# EAGLE design Car_Board (EAGLE 6.4)
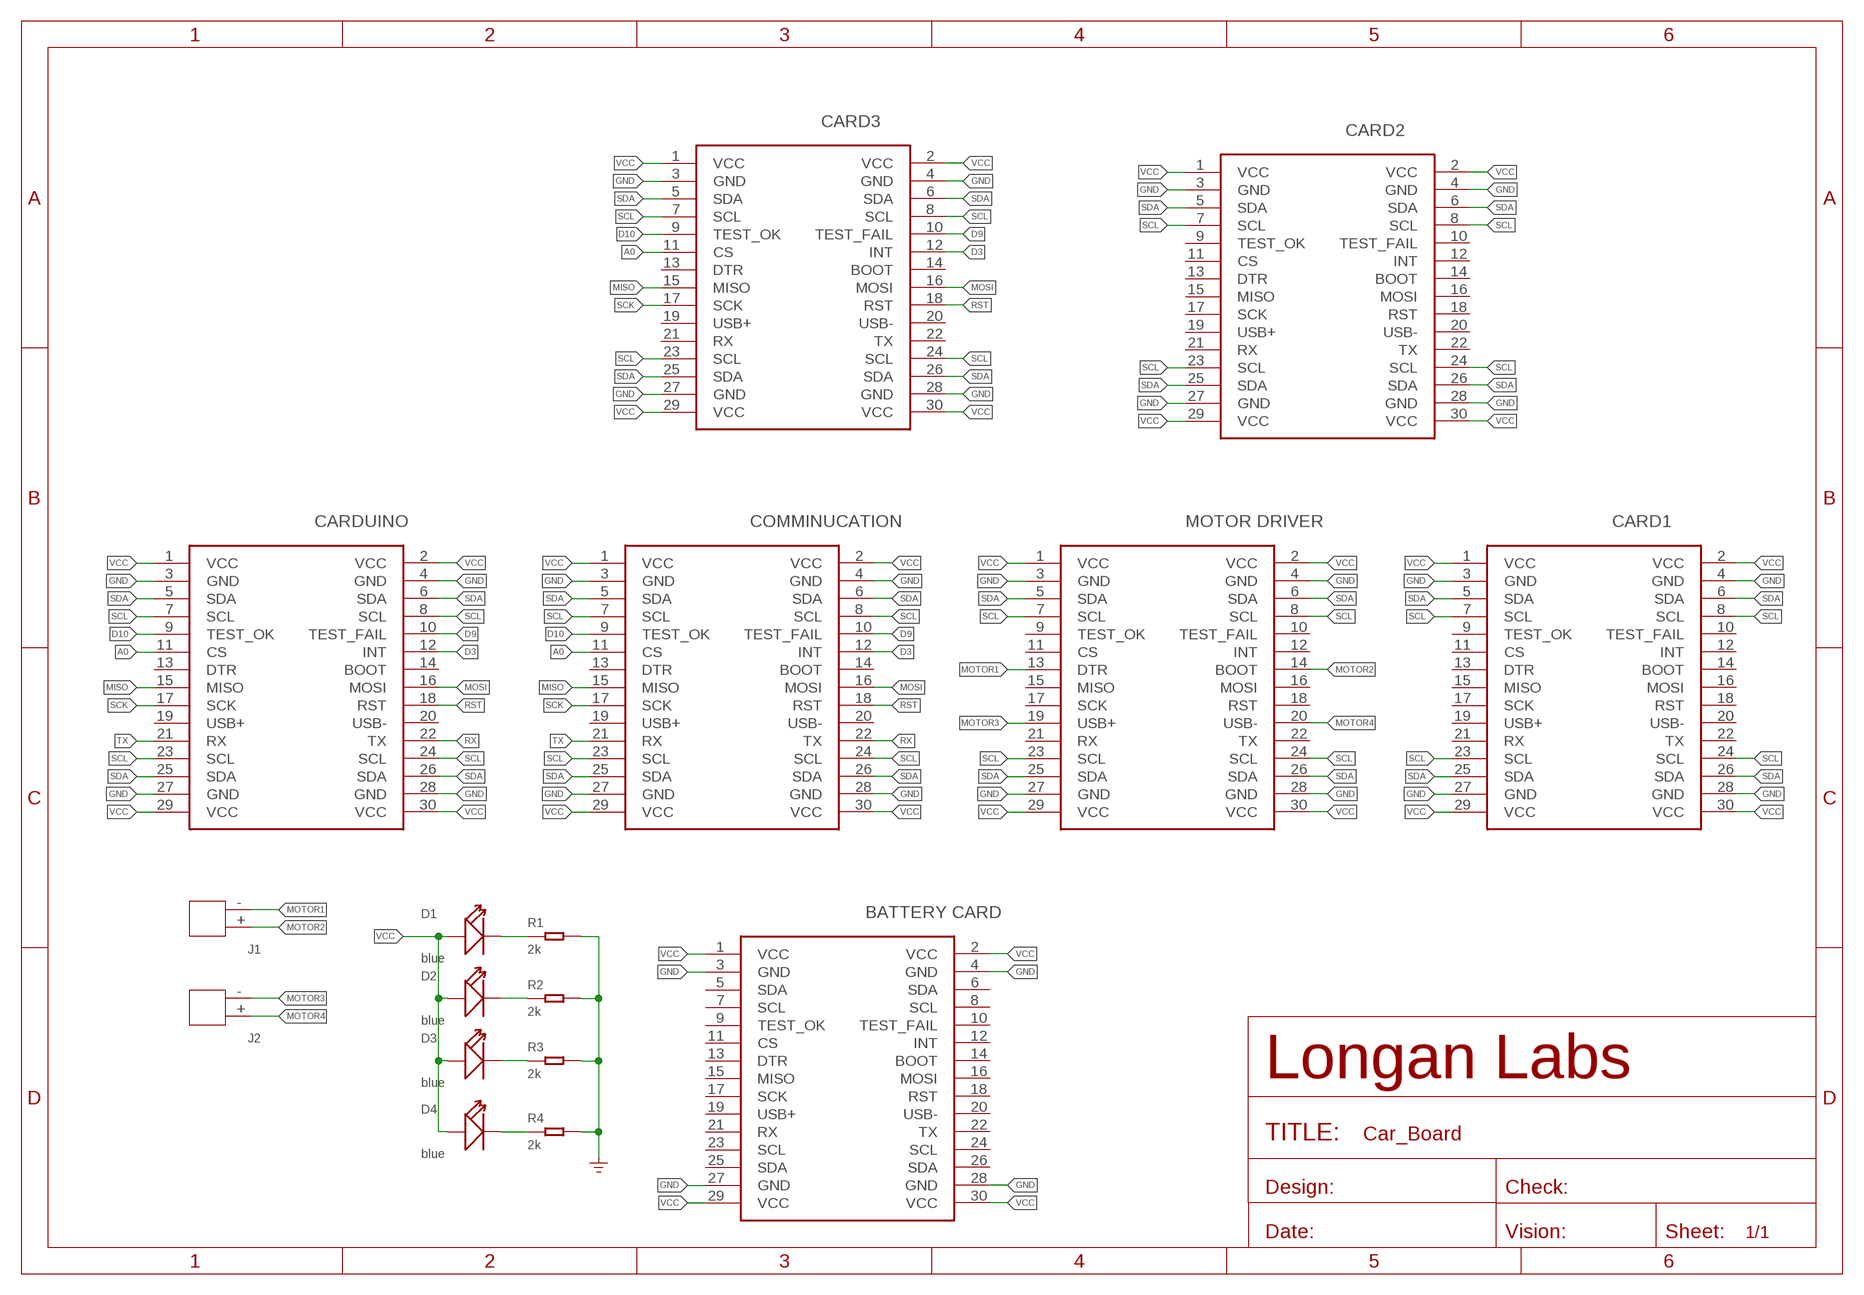
[diagram p0: schematic, sheet 1]

## Parts
CARDUINO  CARDUINO  MOUDLE-2X15P-2.54'2.54'  [2X15P-2.54]
CARDUINO1  COMMINUCATION  MOUDLE-2X15P-2.54'2.54'  [2X15P-2.54]
CARDUINO2  MOTOR DRIVER  MOUDLE-2X15P-2.54'2.54'  [2X15P-2.54]
CARDUINO3  CARD1  MOUDLE-2X15P-2.54'2.54'  [2X15P-2.54]
CARDUINO4  CARD2  MOUDLE-2X15P-2.54'2.54'  [2X15P-2.54]
CARDUINO5  CARD3  MOUDLE-2X15P-2.54'90D'  [2X15P-2.54-90D]
D1  blue  LED'0603'  [LED-0603]
D2  blue  LED'0603'  [LED-0603]
D3  blue  LED'0603'  [LED-0603]
D4  blue  LED'0603'  [LED-0603]
J1  JST-2P-DIP'2.0'  [H2-2.0-6X4.5MM]
J2  JST-2P-DIP'2.0'  [H2-2.0-6X4.5MM]
MOUDLE4  BATTERY CARD  MOUDLE-2X15P-2.54'2.54'  [2X15P-2.54]
R1  2k  RES-0603  [R0603]
R2  2k  RES-0603  [R0603]
R3  2k  RES-0603  [R0603]
R4  2k  RES-0603  [R0603]

## Nets
A0: CARDUINO1.11(CS) CARDUINO5.11(CS) CARDUINO.11(CS)
D3: CARDUINO1.12(INT) CARDUINO5.12(INT) CARDUINO.12(INT)
D9: CARDUINO1.10(TEST_FAIL) CARDUINO5.10(TEST_FAIL) CARDUINO.10(TEST_FAIL)
D10: CARDUINO1.9(TEST_OK) CARDUINO5.9(TEST_OK) CARDUINO.9(TEST_OK)
GND: CARDUINO1.3(GND) CARDUINO1.4(GND) CARDUINO1.27(GND) CARDUINO1.28(GND) CARDUINO2.3(GND) CARDUINO2.4(GND) CARDUINO2.27(GND) CARDUINO2.28(GND) CARDUINO3.3(GND) CARDUINO3.4(GND) CARDUINO3.27(GND) CARDUINO3.28(GND) CARDUINO4.3(GND) CARDUINO4.4(GND) CARDUINO4.27(GND) CARDUINO4.28(GND) CARDUINO5.3(GND) CARDUINO5.4(GND) CARDUINO5.27(GND) CARDUINO5.28(GND) CARDUINO.3(GND) CARDUINO.4(GND) CARDUINO.27(GND) CARDUINO.28(GND) MOUDLE4.3(GND) MOUDLE4.4(GND) MOUDLE4.27(GND) MOUDLE4.28(GND) R1.2 R2.2 R3.2 R4.2 ; supply symbol labelled GND_POWER
MISO: CARDUINO1.15(MISO) CARDUINO5.15(MISO) CARDUINO.15(MISO)
MOSI: CARDUINO1.16(MOSI) CARDUINO5.16(MOSI) CARDUINO.16(MOSI)
MOTOR1: CARDUINO2.13(DTR) J1.-
MOTOR2: CARDUINO2.14(BOOT) J1.+
MOTOR3: CARDUINO2.19(USB+) J2.-
MOTOR4: CARDUINO2.20(USB-) J2.+
N$5: D1.- R1.1
N$6: D2.- R2.1
N$7: D3.- R3.1
N$8: D4.- R4.1
RST: CARDUINO1.18(RST) CARDUINO5.18(RST) CARDUINO.18(RST)
RX: CARDUINO1.22(TX) CARDUINO.22(TX)
SCK: CARDUINO1.17(SCK) CARDUINO5.17(SCK) CARDUINO.17(SCK)
SCL: CARDUINO1.7(SCL) CARDUINO1.8(SCL) CARDUINO1.23(SCL) CARDUINO1.24(SCL) CARDUINO2.7(SCL) CARDUINO2.8(SCL) CARDUINO2.23(SCL) CARDUINO2.24(SCL) CARDUINO3.7(SCL) CARDUINO3.8(SCL) CARDUINO3.23(SCL) CARDUINO3.24(SCL) CARDUINO4.7(SCL) CARDUINO4.8(SCL) CARDUINO4.23(SCL) CARDUINO4.24(SCL) CARDUINO5.7(SCL) CARDUINO5.8(SCL) CARDUINO5.23(SCL) CARDUINO5.24(SCL) CARDUINO.7(SCL) CARDUINO.8(SCL) CARDUINO.23(SCL) CARDUINO.24(SCL)
SDA: CARDUINO1.5(SDA) CARDUINO1.6(SDA) CARDUINO1.25(SDA) CARDUINO1.26(SDA) CARDUINO2.5(SDA) CARDUINO2.6(SDA) CARDUINO2.25(SDA) CARDUINO2.26(SDA) CARDUINO3.5(SDA) CARDUINO3.6(SDA) CARDUINO3.25(SDA) CARDUINO3.26(SDA) CARDUINO4.5(SDA) CARDUINO4.6(SDA) CARDUINO4.25(SDA) CARDUINO4.26(SDA) CARDUINO5.5(SDA) CARDUINO5.6(SDA) CARDUINO5.25(SDA) CARDUINO5.26(SDA) CARDUINO.5(SDA) CARDUINO.6(SDA) CARDUINO.25(SDA) CARDUINO.26(SDA)
TX: CARDUINO1.21(RX) CARDUINO.21(RX)
VCC: CARDUINO1.1(VCC) CARDUINO1.2(VCC) CARDUINO1.29(VCC) CARDUINO1.30(VCC) CARDUINO2.1(VCC) CARDUINO2.2(VCC) CARDUINO2.29(VCC) CARDUINO2.30(VCC) CARDUINO3.1(VCC) CARDUINO3.2(VCC) CARDUINO3.29(VCC) CARDUINO3.30(VCC) CARDUINO4.1(VCC) CARDUINO4.2(VCC) CARDUINO4.29(VCC) CARDUINO4.30(VCC) CARDUINO5.1(VCC) CARDUINO5.2(VCC) CARDUINO5.29(VCC) CARDUINO5.30(VCC) CARDUINO.1(VCC) CARDUINO.2(VCC) CARDUINO.29(VCC) CARDUINO.30(VCC) D1.+ D2.+ D3.+ D4.+ MOUDLE4.1(VCC) MOUDLE4.2(VCC) MOUDLE4.29(VCC) MOUDLE4.30(VCC)
Unconnected: CARDUINO1.13(DTR) CARDUINO1.14(BOOT) CARDUINO1.19(USB+) CARDUINO1.20(USB-) CARDUINO2.9(TEST_OK) CARDUINO2.10(TEST_FAIL) CARDUINO2.11(CS) CARDUINO2.12(INT) CARDUINO2.15(MISO) CARDUINO2.16(MOSI) CARDUINO2.17(SCK) CARDUINO2.18(RST) CARDUINO2.21(RX) CARDUINO2.22(TX) CARDUINO3.9(TEST_OK) CARDUINO3.10(TEST_FAIL) CARDUINO3.11(CS) CARDUINO3.12(INT) CARDUINO3.13(DTR) CARDUINO3.14(BOOT) CARDUINO3.15(MISO) CARDUINO3.16(MOSI) CARDUINO3.17(SCK) CARDUINO3.18(RST) CARDUINO3.19(USB+) CARDUINO3.20(USB-) CARDUINO3.21(RX) CARDUINO3.22(TX) CARDUINO4.9(TEST_OK) CARDUINO4.10(TEST_FAIL) CARDUINO4.11(CS) CARDUINO4.12(INT) CARDUINO4.13(DTR) CARDUINO4.14(BOOT) CARDUINO4.15(MISO) CARDUINO4.16(MOSI) CARDUINO4.17(SCK) CARDUINO4.18(RST) CARDUINO4.19(USB+) CARDUINO4.20(USB-) CARDUINO4.21(RX) CARDUINO4.22(TX) CARDUINO5.13(DTR) CARDUINO5.14(BOOT) CARDUINO5.19(USB+) CARDUINO5.20(USB-) CARDUINO5.21(RX) CARDUINO5.22(TX) CARDUINO.13(DTR) CARDUINO.14(BOOT) CARDUINO.19(USB+) CARDUINO.20(USB-) MOUDLE4.5(SDA) MOUDLE4.6(SDA) MOUDLE4.7(SCL) MOUDLE4.8(SCL) MOUDLE4.9(TEST_OK) MOUDLE4.10(TEST_FAIL) MOUDLE4.11(CS) MOUDLE4.12(INT) MOUDLE4.13(DTR) MOUDLE4.14(BOOT) MOUDLE4.15(MISO) MOUDLE4.16(MOSI) MOUDLE4.17(SCK) MOUDLE4.18(RST) MOUDLE4.19(USB+) MOUDLE4.20(USB-) MOUDLE4.21(RX) MOUDLE4.22(TX) MOUDLE4.23(SCL) MOUDLE4.24(SCL) MOUDLE4.25(SDA) MOUDLE4.26(SDA)

## Library data of the parts
CARDUINO CARDUINO1-CARDUINO5 MOUDLE4 = Longan-moudle:MOUDLE-2X15P-2.54
D1-D4 = Discrete-new:LED
J1 J2 = Connector-new:JST-2P-DIP: 2P-2.0:320110049;2P-2.0-90D:320110027;2P-2.54:320110053;2P-2.54-90D:320110000
R1-R4 = Discrete-new:RES

## Net classes
0 default: width 0.152 mm, clearance 0.152 mm
2 gnd: width 0.152 mm, drill 0.152 mm, clearance 0.152 mm
3 usbvcc: width 0.152 mm, drill 0.152 mm, clearance 0.152 mm

## Board
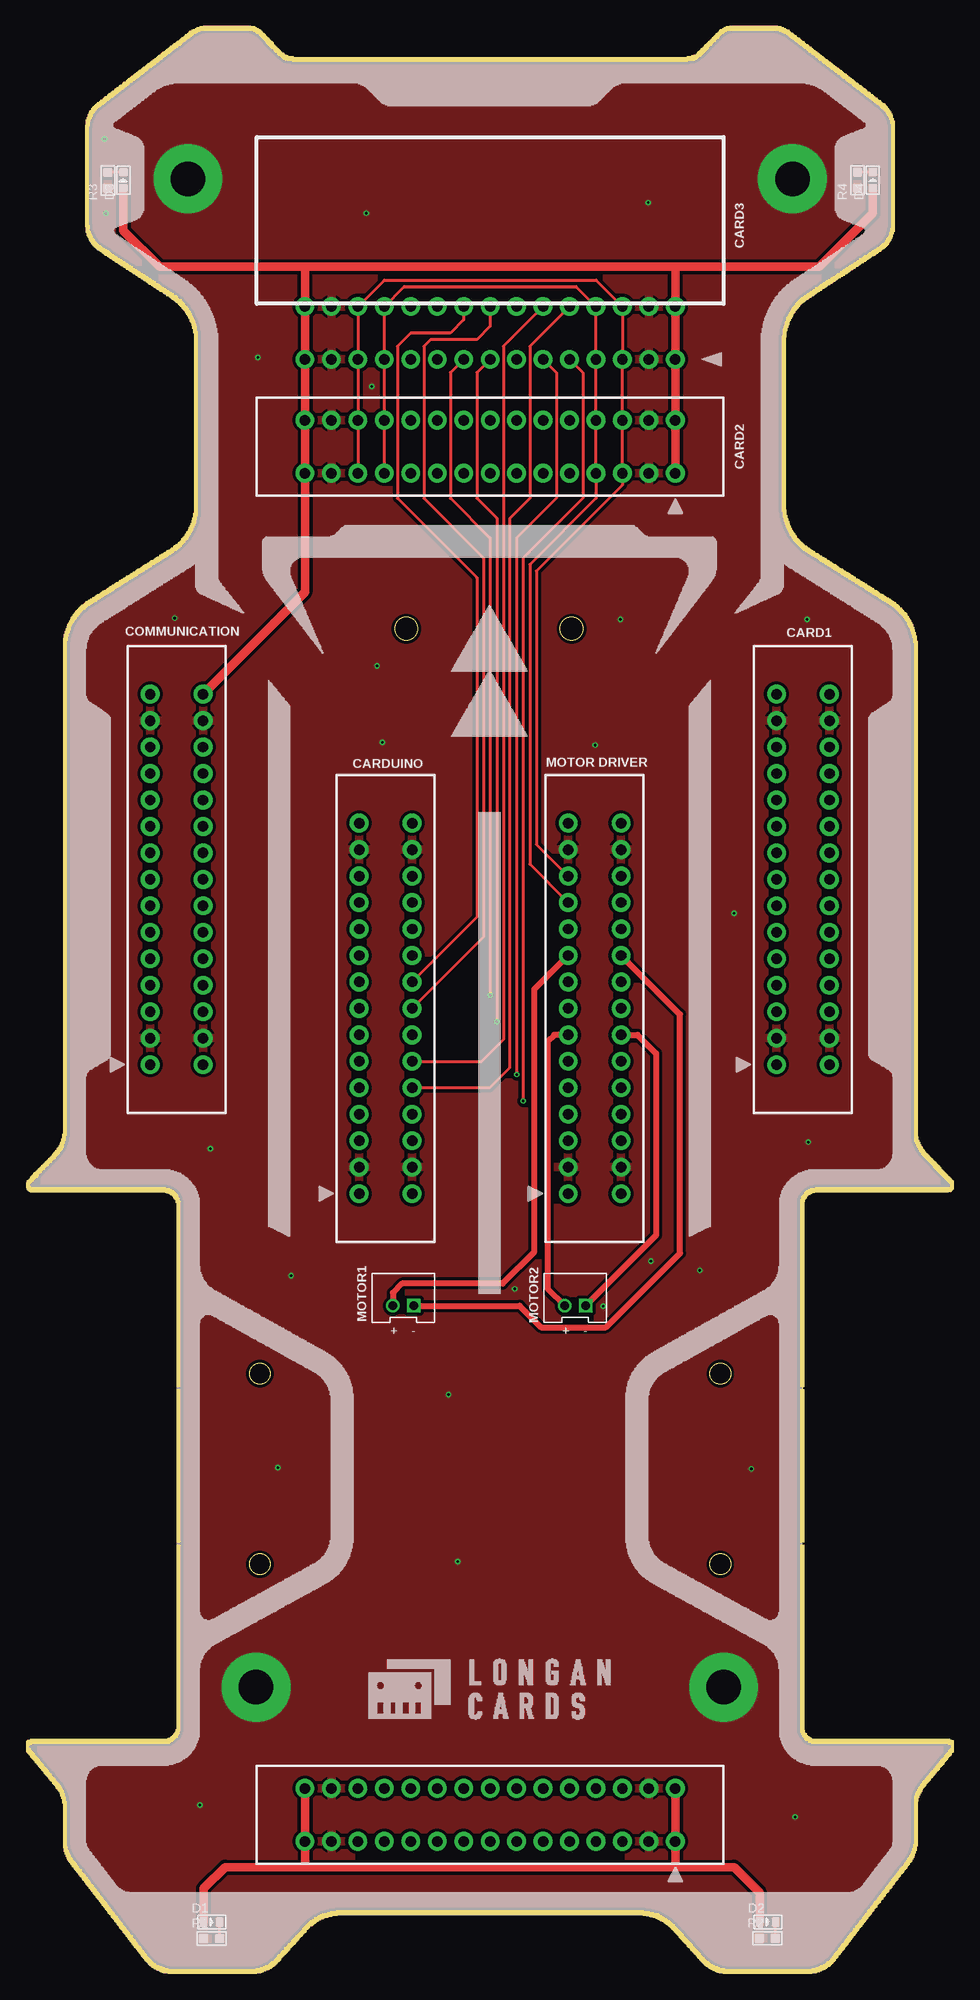
[diagram p1: board, top side]
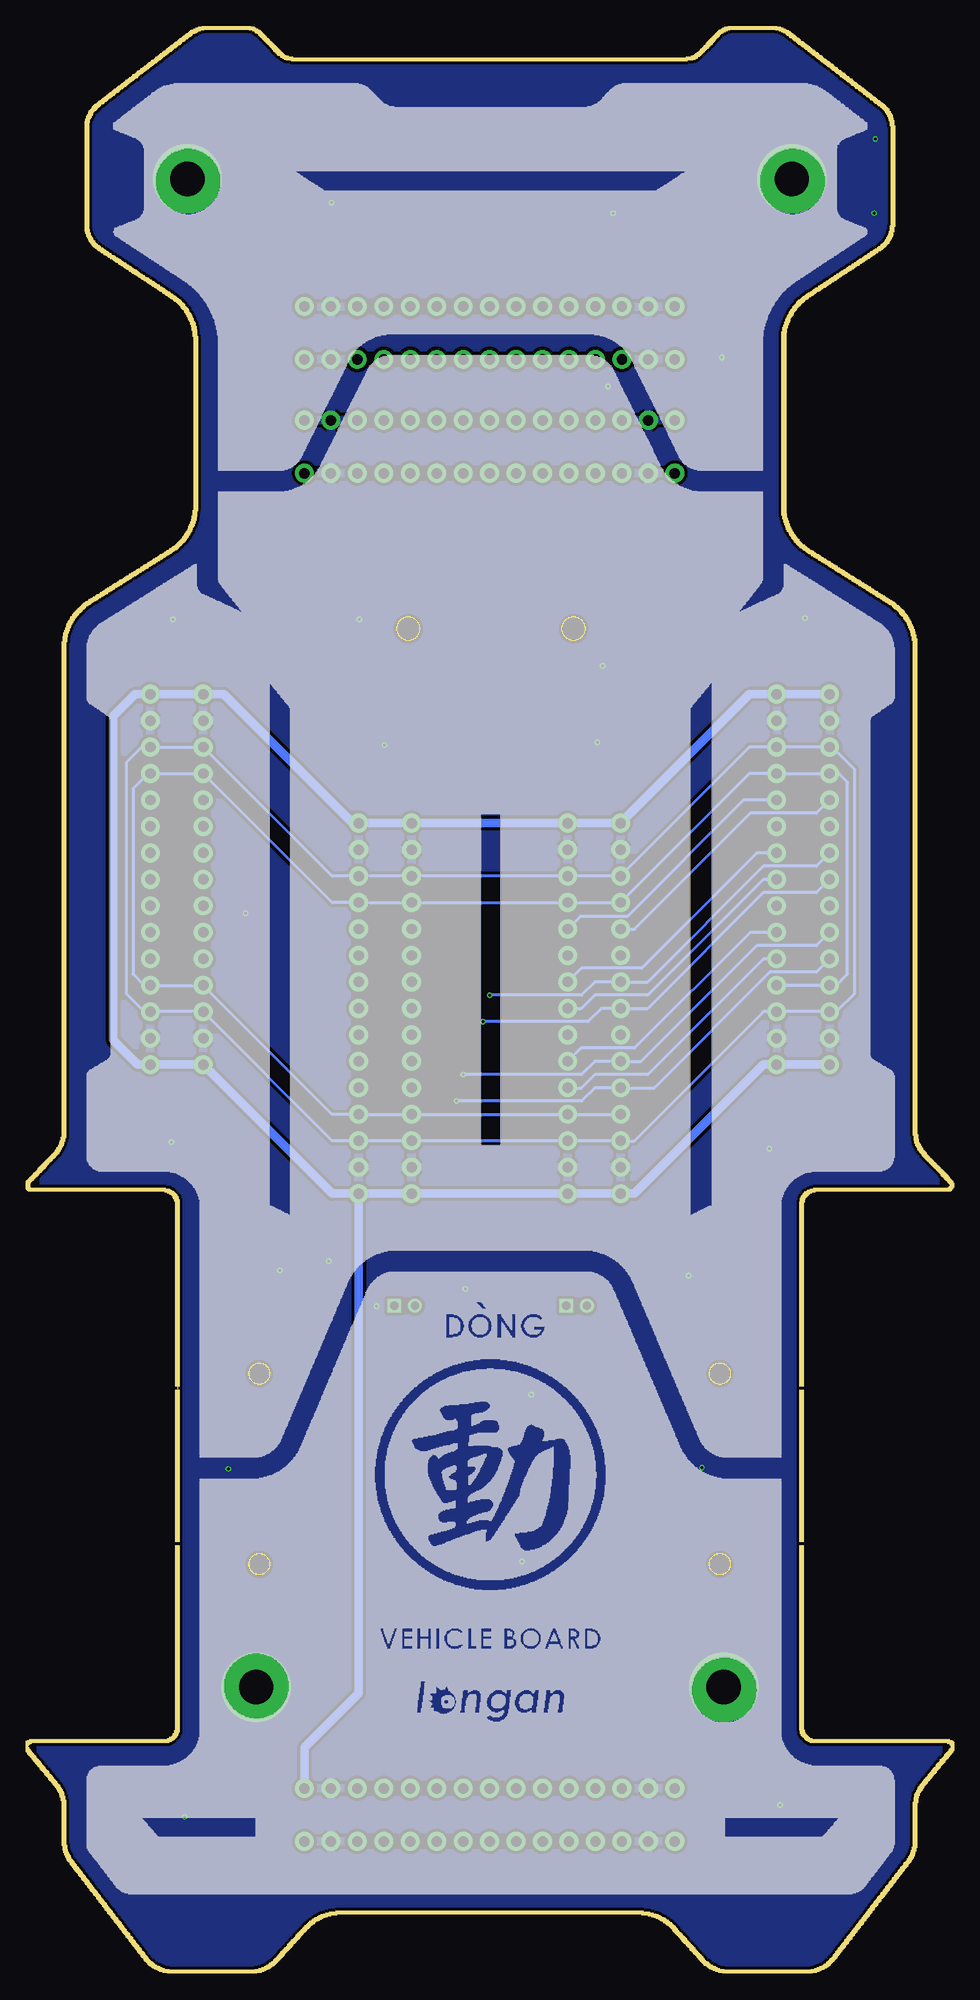
[diagram p2: board, bottom side, seen from below]

Size 89.06 x 186.91 mm. Coordinates in mm from the lower left corner, seen from the top.
Outline: 74.53,56.37 74.53,55.99
Outline: circle at 22.45,57.56 radius 1
Outline: circle at 22.45,39.27 radius 1
Outline: circle at 66.67,39.27 radius 1
Outline: circle at 66.67,57.56 radius 1
Outline: circle at 36.5,129.07 radius 1.1
Outline: circle at 52.37,129.07 radius 1.1
Copper layers (1*16): Top 0.035mm / dielectric 1.5mm / Bottom 0.035mm
Design rules "SeeedStudio_2layer_DRU_no_angle_20140221": minimum track width 1mil, minimum drill 10mil, track to track 6mil, track to pad 6mil, pad to pad 6mil, via to via 6mil, smd to smd 0mil, copper to edge 10mil, drill to drill 10mil, minimum pad ring 4mil, minimum via ring 4mil, stop-mask expansion 2mil, vias tented up to drill 25mil, thermal gap 10mil

### Footprints (pad centres in the part's own frame; a part is rotated, then mirrored left to right if it is on the bottom)
2X15P-2.54 = drill 1 pad 1.8: 1 -17.78,2.54; 2 -17.78,-2.54; 3 -15.24,2.54; 4 -15.24,-2.54; 5 -12.7,2.54; 6 -12.7,-2.54; 7 -10.16,2.54; 8 -10.16,-2.54; 9 -7.62,2.54; 10 -7.62,-2.54; 11 -5.08,2.54; 12 -5.08,-2.54; 13 -2.54,2.54; 14 -2.54,-2.54; 15 0,2.54; 16 0,-2.54; 17 2.54,2.54; 18 2.54,-2.54; 19 5.08,2.54; 20 5.08,-2.54; 21 7.62,2.54; 22 7.62,-2.54; 23 10.16,2.54; 24 10.16,-2.54; 25 12.7,2.54; 26 12.7,-2.54; 27 15.24,2.54; 28 15.24,-2.54; 29 17.78,2.54; 30 17.78,-2.54
2X15P-2.54-90D = drill 1 pad 1.8: 1 17.78,-13.335; 2 17.78,-8.255; 3 15.24,-13.335; 4 15.24,-8.255; 5 12.7,-13.335; 6 12.7,-8.255; 7 10.16,-13.335; 8 10.16,-8.255; 9 7.62,-13.335; 10 7.62,-8.255; 11 5.08,-13.335; 12 5.08,-8.255; 13 2.54,-13.335; 14 2.54,-8.255; 15 0,-13.335; 16 0,-8.255; 17 -2.54,-13.335; 18 -2.54,-8.255; 19 -5.08,-13.335; 20 -5.08,-8.255; 21 -7.62,-13.335; 22 -7.62,-8.255; 23 -10.16,-13.335; 24 -10.16,-8.255; 25 -12.7,-13.335; 26 -12.7,-8.255; 27 -15.24,-13.335; 28 -15.24,-8.255; 29 -17.78,-13.335; 30 -17.78,-8.255
LED-0603 = smd 0.762 x 0.889: + -0.762,0; - 0.762,0
H2-2.0-6X4.5MM = drill 0.8 pad 1.3 square: + -1,0.75 | drill 0.8 pad 1.3: - 1,0.75
R0603 = smd 0.889 x 0.889: 1 0,0.762; 2 0,-0.762

### Placement (x,y rotation side)
CARDUINO  14.46,105.01 90 top
CARDUINO1  34.52,92.63 90 top
CARDUINO2  54.59,92.63 90 top
CARDUINO3  74.59,105.01 90 top
CARDUINO4  44.56,146.54 180 top
CARDUINO5  44.56,168.25 0 top
D1  17.81,4.94 0 top
D2  71.21,4.94 0 top
D3  9.34,172.12 90 top
D4  81.3,172.13 90 top
J1  52.72,64.83 180 top
J2  36.21,64.83 180 top
MOUDLE4  44.56,15.22 180 top
R1  17.81,3.35 270 top
R2  71.17,3.38 270 top
R3  7.86,172.1 0 top
R4  79.83,172.11 0 top

### Tracks (layer width: path | path; a pad name or v marks a point on that pad's centre or on a via)
A0  (via drill 0.25 pad 0.51)
  Top 0.305: CARDUINO5.11 50.91,153.65 50.91,141.58 47.1,137.77 v47.1,86.28
  Bottom 0.305: CARDUINO.11 13.19,98.66 18.9,98.66 30.01,87.55 CARDUINO1.11 34.46,87.55 35.73,86.28 v47.1,86.28
D3
  Top 0.305: CARDUINO5.12 45.83,156.19 45.83,89.64 43.73,87.55 CARDUINO1.12
  Bottom 0.305: CARDUINO.12 19.54,99.93 30.65,88.82 35.79,88.82 CARDUINO1.12
D9
  Top 0.305: CARDUINO5.10 48.37,156.19 48.37,141.58 46.46,139.68 46.46,86.97 44.49,85.01 CARDUINO1.10
  Bottom 0.305: CARDUINO.10 18.27,97.39 29.38,86.28 34.46,86.28 35.73,85.01 CARDUINO1.10
D10  (via drill 0.25 pad 0.51)
  Top 0.305: CARDUINO5.9 53.45,153.65 53.45,141.58 47.73,135.87 v47.73,83.74
  Bottom 0.305: CARDUINO.9 13.19,96.12 17.63,96.12 28.74,85.01 CARDUINO1.9 34.46,85.01 35.73,83.74 v47.73,83.74
GND  (via drill 0.25 pad 0.51, 3.3 pad 6.6)
  other vias: 22.08,27.47 66.97,27.47 73.58,172.25 15.54,172.25 7.66,168.95 7.54,176.06 32.68,168.95 59.73,169.97 22.27,155.11 57.07,129.96 33.7,125.52 67.99,101.77 34.21,118.15 54.65,117.9 74.97,129.96 14.27,130.09 75.1,79.8 17.7,79.16 25.44,66.97 64.69,67.48 40.56,55.54 69.64,48.43 41.44,39.54 24.17,48.56 16.68,16.17 73.83,15.03 33.19,152.32 46.91,65.7 59.99,68.37 55.41,64.05
  pour Top (isolate 0.305): -6.63,187.43 97.26,187.3 97.39,-7.77 -6.75,-7.77
  pour Bottom (isolate 0.305): -6.63,187.43 97.26,187.3 97.39,-7.77 -6.75,-7.77
MISO  (via drill 0.25 pad 0.51)
  Top 0.305: CARDUINO5.15 43.29,153.65 43.29,141.58 45.19,139.68 v45.19,91.36
  Bottom 0.305: CARDUINO.15 13.19,103.74 18.27,103.74 29.38,92.63 CARDUINO1.15 33.82,92.63 35.09,91.36 v45.19,91.36
MOSI
  Top 0.305: CARDUINO5.16 44.56,158.09 43.29,156.82 38.84,156.82 38.21,156.19 38.21,141.58 43.92,135.87 43.92,99.48 CARDUINO1.16
  Bottom 0.305: CARDUINO.16 18.27,105.01 29.38,93.9 34.46,93.9 35.73,92.63 CARDUINO1.16
MOTOR1
  Top 0.559: CARDUINO2.13 50.72,90.09 50.08,89.45 50.08,65.72 J1.-
MOTOR2
  Top 0.559: CARDUINO2.14 58.72,90.09 60.49,88.31 60.49,70.86 J1.+
MOTOR3
  Top 0.559: CARDUINO2.19 48.81,94.47 48.81,69.26 45.76,66.21 36.11,66.21 35.22,65.32 J2.-
MOTOR4
  Top 0.559: J2.+ 47.38,64.08 49.45,62.02 55.67,62.02 62.78,69.13 62.78,92.05 CARDUINO2.20
N$5
  Top 0.305: R1.1 D1.-
N$6
  Top 0.305: R2.1 71.93,4.9 D2.-
N$7
  Top 0.305: D3.- 7.88,172.88 R3.1
N$8
  Top 0.305: D4.- 79.85,172.89 R4.1
RST
  Top 0.305: CARDUINO5.18 42.02,158.73 40.75,157.46 36.94,157.46 35.67,156.19 35.67,141.58 43.29,133.96 43.29,101.39 CARDUINO1.18
  Bottom 0.305: CARDUINO.18 18.9,107.55 29.95,96.5 35.73,96.5 CARDUINO1.18
RX
  Bottom 0.305: CARDUINO1.22 35.79,101.52 31.28,101.52 20.17,112.63 CARDUINO.22
SCK  (via drill 0.25 pad 0.51)
  Top 0.305: CARDUINO5.17 40.75,153.65 40.75,141.58 44.56,137.77 v44.56,93.9
  Bottom 0.305: CARDUINO.17 13.19,106.28 18.27,106.28 29.38,95.17 CARDUINO1.17 34.46,95.17 35.73,93.9 v44.56,93.9
SCL
  Top 0.305: CARDUINO4.23 CARDUINO4.24 CARDUINO5.23 CARDUINO5.24 36.3,161.9 52.81,161.9 CARDUINO5.8 CARDUINO5.7 CARDUINO4.8 CARDUINO4.7 54.72,141.58 48.37,135.23 48.37,106.47 CARDUINO2.23
  Bottom 0.305: CARDUINO1.7 CARDUINO1.8 CARDUINO2.7 CARDUINO2.8 59.67,82.47 CARDUINO3.7 CARDUINO3.8 77.7,94.85 78.78,95.93 78.78,113.71 77.32,115.17 CARDUINO3.24 CARDUINO3.23 59.67,102.79 CARDUINO2.24 CARDUINO2.23 CARDUINO1.24 CARDUINO1.23 19.6,115.17 CARDUINO.24 CARDUINO.23 11.03,115.17 10.2,114.34 10.2,95.93 11.28,94.85 CARDUINO.7 CARDUINO.8
SDA
  Top 0.305: CARDUINO4.25 CARDUINO4.26 CARDUINO5.25 CARDUINO5.26 34.4,162.54 54.72,162.54 CARDUINO5.6 CARDUINO5.5 CARDUINO4.6 CARDUINO4.5 57.26,142.85 49,134.6 49,108.37 CARDUINO2.25
  Bottom 0.305: CARDUINO.25 CARDUINO.26 19.6,117.71 CARDUINO1.25 CARDUINO1.26 CARDUINO2.25 CARDUINO2.26 59.67,105.33 CARDUINO3.25 CARDUINO3.26 77.96,117.71 79.42,116.25 79.42,94.02 77.7,92.31 CARDUINO3.6 CARDUINO3.5 59.67,79.93 CARDUINO2.6 CARDUINO2.5 CARDUINO1.6 CARDUINO1.5 30.65,79.93 18.58,91.99 18.33,92.24 18.27,92.31 CARDUINO.6 CARDUINO.5 11.28,92.31 9.57,94.02 9.57,115.61 11.66,117.71 CARDUINO.25
TX
  Bottom 0.305: CARDUINO.21 13.19,111.36 19.54,111.36 30.65,100.25 CARDUINO1.21
VCC
  Top 0.813: CARDUINO4.1 CARDUINO4.2 CARDUINO5.1 CARDUINO5.2 62.34,163.62 62.53,163.81 | 26.84,163.81 12.81,163.81 9.34,167.27 D3.+ | 26.84,163.81 62.53,163.81 | 62.53,163.81 76.18,163.81 81.3,168.93 D4.+ | 26.84,163.81 26.78,163.75 CARDUINO5.30 CARDUINO5.29 CARDUINO4.30 CARDUINO4.29 26.78,132.57 CARDUINO.30 | MOUDLE4.29 MOUDLE4.30 26.78,10.39 26.59,10.2 | 26.59,10.2 19.09,10.2 17.05,8.16 D1.+ | 26.59,10.2 62.4,10.2 | 62.4,10.2 67.99,10.2 70.45,7.74 D2.+ | MOUDLE4.2 MOUDLE4.1 62.34,10.27 62.4,10.2
  Bottom 0.813: CARDUINO.29 CARDUINO.30 19.6,122.79 CARDUINO1.29 CARDUINO1.30 CARDUINO2.29 CARDUINO2.30 57.7,110.41 70.08,122.79 CARDUINO3.29 CARDUINO3.30 78.59,122.79 80.69,120.69 80.69,89.58 78.34,87.23 CARDUINO3.2 CARDUINO3.1 59.67,74.85 CARDUINO2.2 | CARDUINO.1 CARDUINO.2 18.27,87.23 30.65,74.85 CARDUINO1.1 CARDUINO1.2 CARDUINO2.1 CARDUINO2.2 | CARDUINO2.2 57.13,26.9 62.34,21.7 MOUDLE4.2

### Text on the board
tPlace: CARD3 | CARD2 | COMMUNICATION | CARD1 | CARDUINO | MOTOR DRIVER | MOTOR1 | MOTOR2 | + | - | + | -